# EAGLE design 24_cup_wash_sucction (EAGLE 8.5.1)

## Sheet 1 of 3
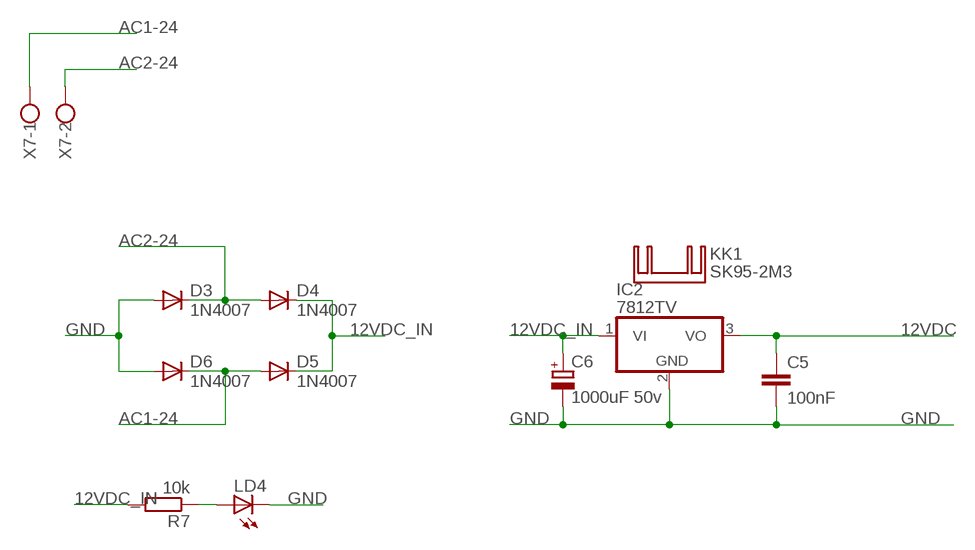
[diagram p0: schematic, sheet 1]

### Parts
C5  100nF  C-EU050-025X075  [C050-025X075]
C6  1000uF 50v  CPOL-EUE5-13  [E5-13]
D3  1N4007  1N4004  [DO41-10]
D4  1N4007  1N4004  [DO41-10]
D5  1N4007  1N4004  [DO41-10]
D6  1N4007  1N4004  [DO41-10]
IC2  7812TV  [TO220V]
KK1  SK95-2M3  [SK95-2M3]
LD4  LED5MM  [LED5MM]
R7  10k  R-EU_0207/10  [0207/10]
X7  W237-102  [W237-102]

### Nets
12VDC: C5.1 IC2.3(VO) ; also sheet 2
12VDC_IN: C6.+ D4.C D5.C IC2.1(VI) R7.2 ; also sheet 2,3
AC1-24: D5.A D6.C X7.1 ; also sheet 2,3
AC2-24: D3.C D4.A X7.2 ; also sheet 2,3
GND: C5.2 C6.- D3.A D6.A IC2.2(GND) LD4.K(C) ; also sheet 2,3
N$8: LD4.A R7.1

## Sheet 2 of 3
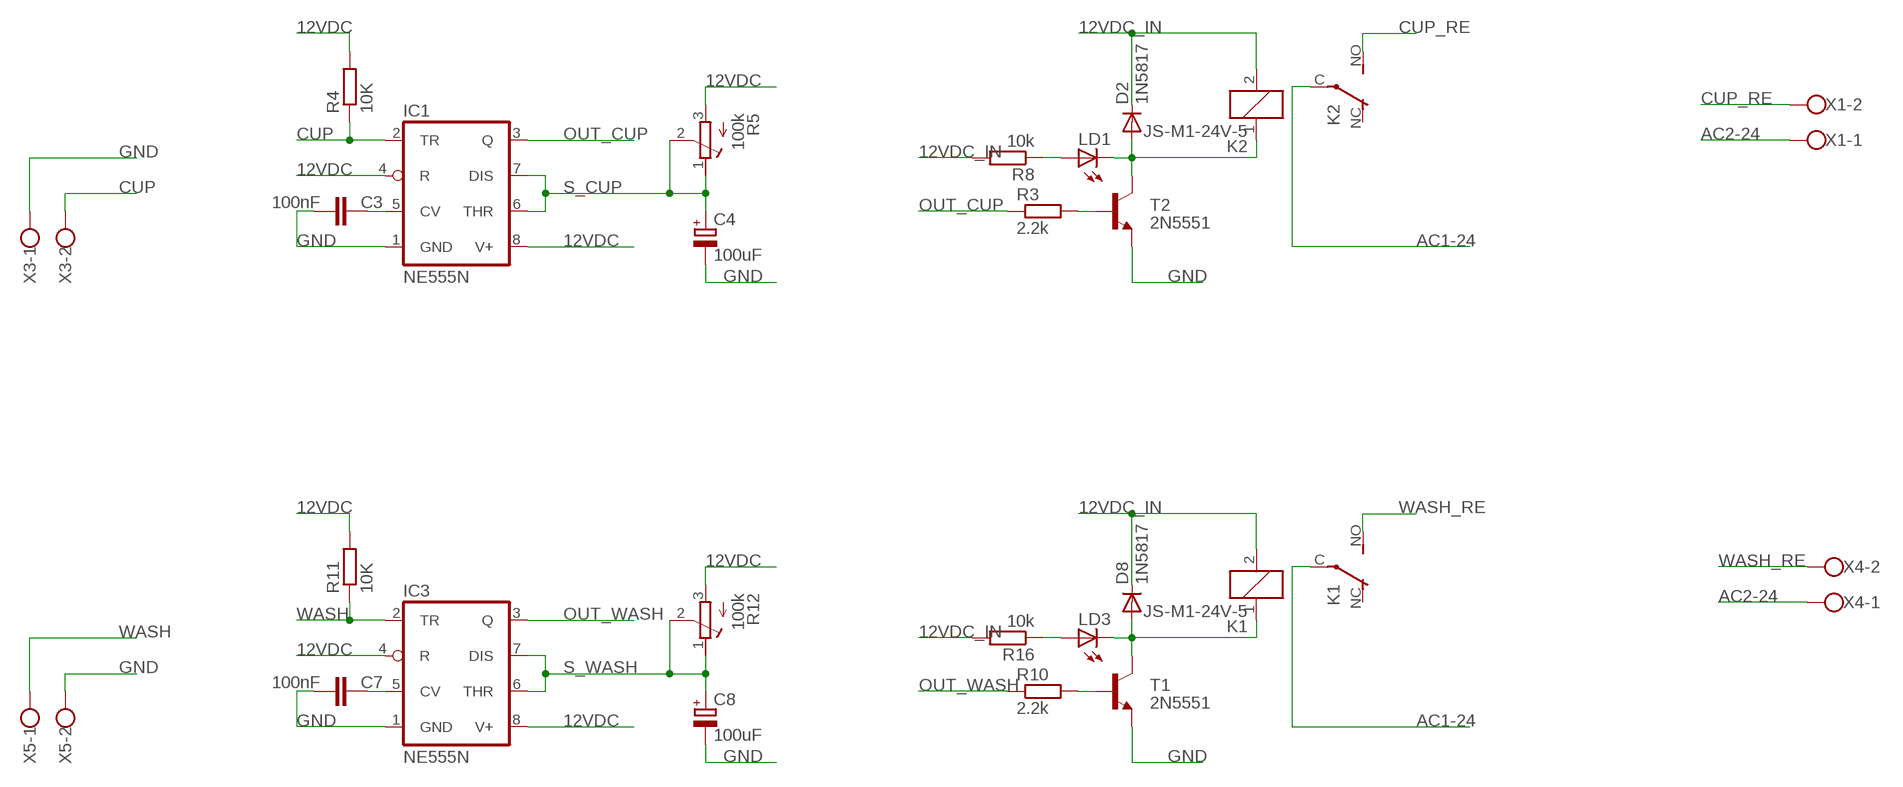
[diagram p1: schematic, sheet 2]

### Parts
C3  100nF  C-EU050-025X075  [C050-025X075]
C4  100uF  CPOL-EUE3.5-8  [E3,5-8]
C7  100nF  C-EU050-025X075  [C050-025X075]
C8  100uF  CPOL-EUE3.5-8  [E3,5-8]
D2  1N5817  1N4004  [DO41-10]
D8  1N5817  1N4004  [DO41-10]
IC1  NE555N  [DIL08-ROUND]
IC3  NE555N  [DIL08-ROUND]
K1  JS-M1-24V-5  JS-M1-12V-5  [JS-M]
K2  JS-M1-24V-5  JS-M1-12V-5  [JS-M]
LD1  LED5MM  [LED5MM]
LD3  LED5MM  [LED5MM]
R3  2.2k  R-EU_0207/10  [0207/10]
R4  10K  R-EU_0207/10  [0207/10]
R5  100k  R-TRIMMT93XA  [RTRIMT93XA]
R8  10k  R-EU_0207/10  [0207/10]
R10  2.2k  R-EU_0207/10  [0207/10]
R11  10K  R-EU_0207/10  [0207/10]
R12  100k  R-TRIMMT93XA  [RTRIMT93XA]
R16  10k  R-EU_0207/10  [0207/10]
T1  2N5551  2N2222  [TO92-EBC-OVAL]
T2  2N5551  2N2222  [TO92-EBC-OVAL]
X1  W237-102  [W237-102]
X3  W237-102  [W237-102]
X4  W237-102  [W237-102]
X5  W237-102  [W237-102]

### Nets
12VDC: IC1.4(R) IC1.8(V+) IC3.4(R) IC3.8(V+) R4.2 R5.3(A) R11.2 R12.3(A) ; also sheet 1
12VDC_IN: D2.C D8.C K1.2 K2.2 R8.2 R16.2 ; also sheet 1,3
AC1-24: K1.C(2:P) K2.C(2:P) ; also sheet 1,3
AC2-24: X1.1 X4.1 ; also sheet 1,3
CUP: IC1.2(TR) R4.1 X3.2
CUP_RE: K2.NO(2:S) X1.2
GND: C3.2 C4.- C7.2 C8.- IC1.1(GND) IC3.1(GND) T1.E T2.E X3.1 X5.2 ; also sheet 1,3
N$1: R3.2 T2.B
N$2: C3.1 IC1.5(CV)
N$3: D2.A K2.1 LD1.K(C) T2.C
N$5: C7.1 IC3.5(CV)
N$6: LD1.A R8.1
N$11: D8.A K1.1 LD3.K(C) T1.C
N$12: R10.2 T1.B
N$14: LD3.A R16.1
OUT_CUP: IC1.3(Q) R3.1
OUT_WASH: IC3.3(Q) R10.1
S_CUP: C4.+ IC1.6(THR) IC1.7(DIS) R5.1(E) R5.2(S)
S_WASH: C8.+ IC3.6(THR) IC3.7(DIS) R12.1(E) R12.2(S)
WASH: IC3.2(TR) R11.1 X5.1
WASH_RE: K1.NO(2:S) X4.2
Unconnected: K1.NC(2:O) K2.NC(2:O)

## Sheet 3 of 3
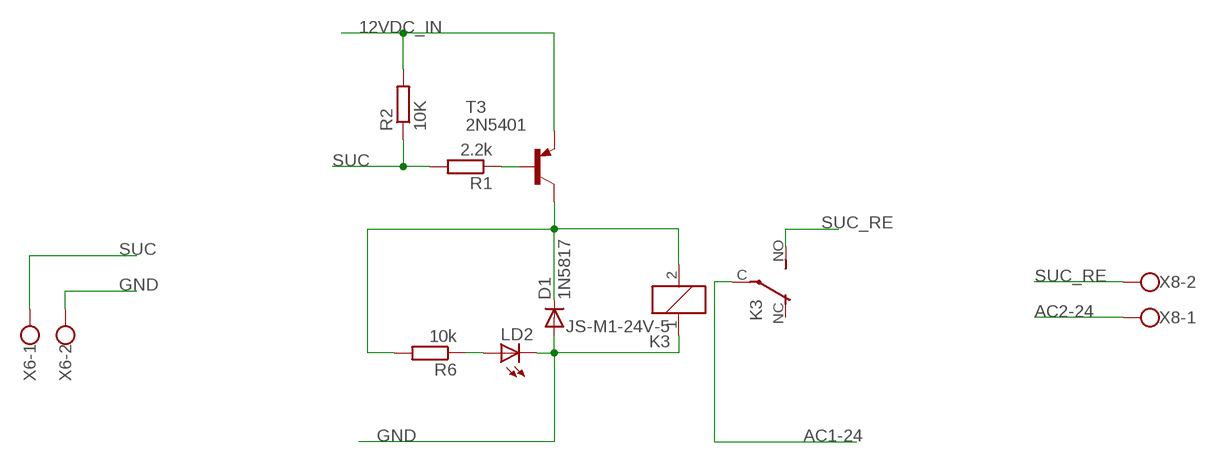
[diagram p2: schematic, sheet 3]

### Parts
D1  1N5817  1N4004  [DO41-10]
K3  JS-M1-24V-5  JS-M1-12V-5  [JS-M]
LD2  LED5MM  [LED5MM]
R1  2.2k  R-EU_0207/10  [0207/10]
R2  10K  R-EU_0207/10  [0207/10]
R6  10k  R-EU_0207/10  [0207/10]
T3  2N5401  2N5401-PNP-TO92-EBC  [TO92-EBC]
X6  W237-102  [W237-102]
X8  W237-102  [W237-102]

### Nets
12VDC_IN: R2.2 T3.E ; also sheet 1,2
AC1-24: K3.C(2:P) ; also sheet 1,2
AC2-24: X8.1 ; also sheet 1,2
GND: D1.A K3.1 LD2.K(C) X6.2 ; also sheet 1,2
N$7: R1.1 T3.B
N$9: LD2.A R6.1
NS1: D1.C K3.2 R6.2 T3.C
SUC: R1.2 R2.1 X6.1
SUC_RE: K3.NO(2:S) X8.2
Unconnected: K3.NC(2:O)

## Library data of the parts
C3 C5 C7 = rcl:C-EU: CAPACITOR, European symbol; SPICEPREFIX: C
C4 C6 C8 = rcl:CPOL-EU: POLARIZED CAPACITOR, European symbol; SPICEPREFIX: C
D1-D6 D8 = adafruit:1N4004: DIODE General purpose 1N400x type rectifier (With bigger pads) http://www.ladyada.net/library/pcb/eaglelibrary.html
IC1 IC3 = adafruit:*555: TIMER Changed DIP package to have round (not oval) pin pads http://www.ladyada.net/library/pcb/eaglelibrary.html
IC2 = linear:78*: Positive VOLTAGE REGULATOR Source: http://cache.national.com/ds/LM/LM78L05.pdf http://www.fairchildsemi.com/ds/LM/LM7805.pdf
K1-K3 = relay:JS-M1*: Automotive Ultra-Miniature Power Relay NAiS Source: http://www.mew-europe.com/.. en_ds_61211_0000.pdf; MF: FARNELL; MPN: JSM1-12V-5; OC_FARNELL: 910351; OC_NEWARK: 14J1764
KK1 = heatsink:SK95-2M3: HEATSINK manufacturer Fischer/distributor Buerklin
LD1-LD4 = led:LED: LED OSRAM: - CHIPLED LG R971, LG N971, LY N971, LG Q971, LY Q971, LO R971, LY R971 LH N974, LH R974 LS Q976, LO Q976, LY Q976 LO Q996 - Hyper CHIPLED LW Q18S LB Q993, LB Q99A, LB R99A - SideLED LS A670, LO A670, LY A670, LG A670, LP A670 LB A673, LV A673, LT A673, LW A673 LH A674 LY A675 LS A676, LA A676, LO A676, LY A676, LW A676 LS A679, LY A679, LG A679 - Hyper Micro SIDELED® LS Y876, LA Y876, LO Y876, LY Y876 LT Y87S - SmartLED LW L88C, LW L88S LB L89C, LB L89S, LG L890 LS L89K, LO L89K, LY L89K LS L896, LA L896, LO L896, LY L896 - TOPLED LS T670, LO T670, LY T670, LG T670, LP T670 LSG T670, LSP T670, LSY T670, LOP T670, LYG T670 LG T671, LOG T671, LSG T671 LB T673, LV T673, LT T673, LW T673 LH T674 LS T676, LA T676, LO T676, LY T676, LB T676, LH T676, LSB T676, LW T676 LB T67C, LV T67C, LT T67C, LS T67K, LO T67K, LY T67K, LW E67C LS E67B, LA E67B, LO E67B, LY E67B, LB E67C, LV E67C, LT E67C LW T67C LS T679, LY T679, LG T679 LS T770, LO T770, LY T770, LG T770, LP T770 LB T773, LV T773, LT T773, LW T773 LH T774 LS E675, LA E675, LY E675, LS T675 LS T776, LA T776, LO T776, LY T776, LB T776 LHGB T686 LT T68C, LB T68C - Hyper Mini TOPLED® LB M676 - Mini TOPLED Santana® LG M470 LS M47K, LO M47K, LY M47K Source: http://www.osram.convergy.de/
R1-R4 R6-R8 R10 R11 R16 = rcl-2:R-EU_: RESISTOR, European symbol
R5 R12 = rcl:R-TRIMM: Trimm resistor; SPICEMODEL: X; SPICEPREFIXL: POT
T1 T2 = adafruit:2N2222: NPN TRANSISTOR Big oval pads
T3 = transistor-neu-to92:*-PNP-: PNP Transistror
X1 X3-X8 = con-wago-500:W237-102: WAGO SCREW CLAMP

## Board
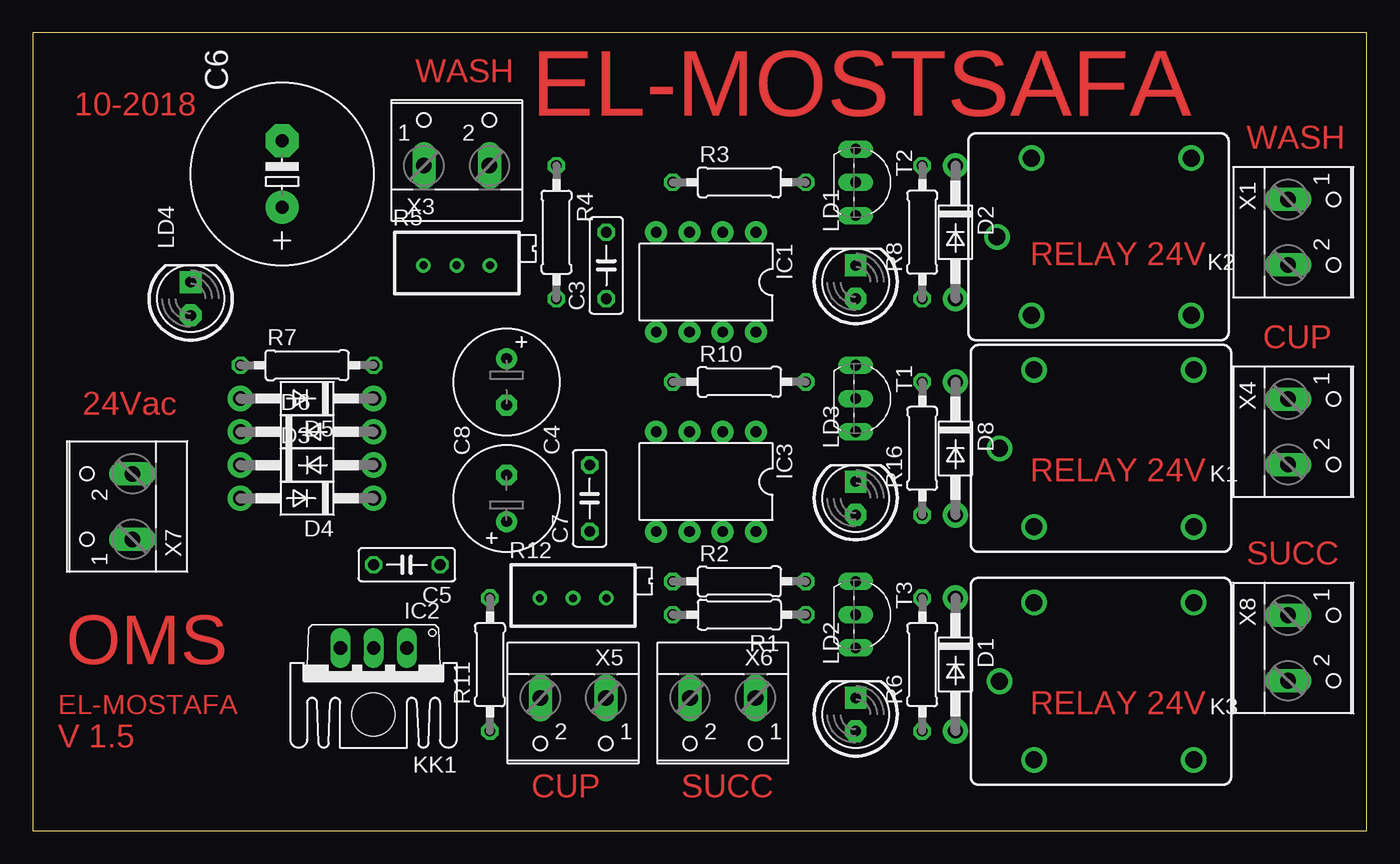
[diagram p3: board, top side]
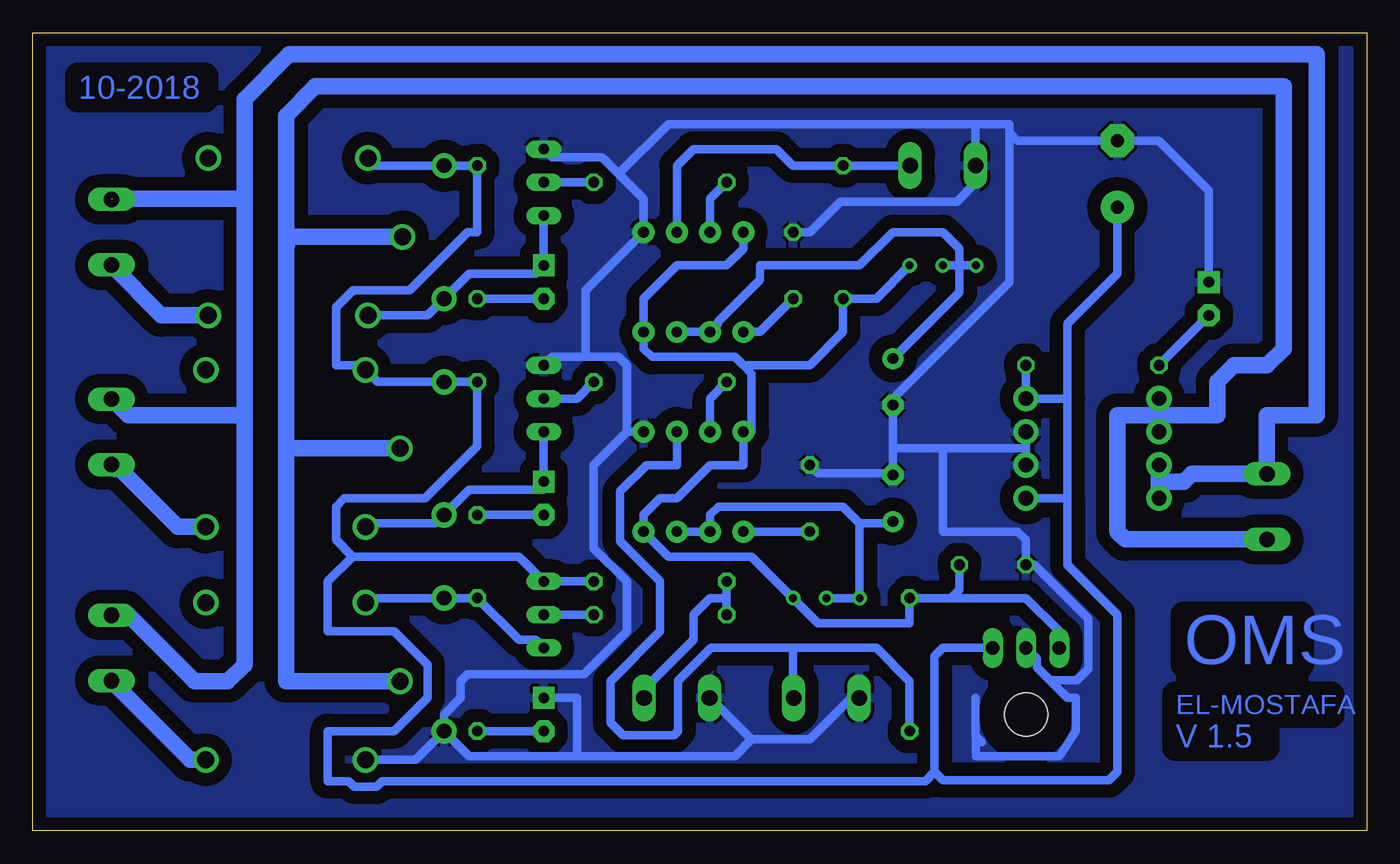
[diagram p4: board, bottom side, seen from below]

Size 101.91 x 60.95 mm. Coordinates in mm from the lower left corner, seen from the top.
Outline: 0,0 101.91,0 101.91,60.95 0,60.95 0,0
Copper layers (1*16): Top 0.035mm / dielectric 1.5mm / Bottom 0.035mm
Design rules "default *": minimum track width 25mil, minimum drill 0.35mm, track to track 40mil, track to pad 40mil, pad to pad 6mil, via to via 6mil, smd to smd 6mil, copper to edge 40mil, drill to drill 6mil, minimum pad ring 10mil, minimum via ring 8mil, stop-mask expansion 4mil, vias tented up to drill 0mil, thermal gap 10mil

### Footprints (pad centres in the part's own frame; a part is rotated, then mirrored left to right if it is on the bottom)
C050-025X075 = drill 0.813 octagon: 1 -2.54,0; 2 2.54,0
E3,5-8 = drill 0.813 pad 1.6: + -1.778,0 | drill 0.813 pad 1.6 octagon: - 1.778,0
E5-13 = drill 1.016 pad 2.54: + -2.54,0 | drill 1.016 pad 2.54 octagon: - 2.54,0
DO41-10 = drill 1.118 pad 1.93: A 5.08,0; C -5.08,0
DIL08-ROUND = drill 0.813 pad 1.676: 1 -3.81,-3.81; 2 -1.27,-3.81; 3 1.27,-3.81; 4 3.81,-3.81; 5 3.81,3.81; 6 1.27,3.81; 7 -1.27,3.81; 8 -3.81,3.81
TO220V = drill 1.016 long: 1 -2.54,-2.54; 2 0,-2.54; 3 2.54,-2.54
JS-M = drill 1.3: 1 6.7,6; 2 6.7,-6; C 9.335,0; NC -5.5,-6; NO -5.5,6
SK95-2M3 = hole 3.302: 0,2.54
LED5MM = drill 0.813 pad 1.676 octagon: A -1.27,0 | drill 0.813 pad 1.676 square: K 1.27,0
0207/10 = drill 0.813 octagon: 1 -5.08,0; 2 5.08,0
RTRIMT93XA = drill 0.61: 1 0,-2.54; 2 0,0; 3 0,2.54
TO92-EBC-OVAL = drill 0.813 long: B 0,-1.27; C 2.54,-1.27; E -2.54,-1.27
TO92-EBC = drill 0.813 long: B 0,-1.27; C 2.54,-1.27; E -2.54,-1.27
W237-102 = drill 1.194 long: 1 -2.5,-1.27; 2 2.5,-1.27

### Placement (x,y rotation side)
C3  43.81,43.18 90 top
C4  36.2,34.29 270 top
C5  28.57,20.32 180 top
C6  19.05,50.16 90 top
C7  42.55,25.4 90 top
C8  36.2,25.4 90 top
D1  70.48,12.7 270 top
D2  70.48,45.72 270 top
D3  20.95,27.94 0 top
D4  20.95,25.4 180 top
D5  20.95,33.02 180 top
D6  20.95,30.48 0 top
D8  70.48,29.21 270 top
IC1  51.44,41.91 180 top
IC2  26.04,11.43 180 top
IC3  51.44,26.67 180 top
K1  83.19,29.21 180 top
K2  83,45.37 180 top
K3  83.19,11.43 180 top
KK1  26.04,11.43 180 top
LD1  62.87,41.91 90 top
LD2  62.87,8.89 90 top
LD3  62.87,25.4 90 top
LD4  12.06,40.64 90 top
R1  53.98,16.51 180 top
R2  53.98,19.05 0 top
R3  53.98,49.53 0 top
R4  40.01,45.72 270 top
R5  32.38,43.18 270 top
R6  67.94,12.7 90 top
R7  20.95,35.56 0 top
R8  67.94,45.72 90 top
R10  53.98,34.29 0 top
R11  34.92,12.7 90 top
R12  41.27,17.78 270 top
R16  67.94,29.21 90 top
T1  64.14,33.02 270 top
T2  64.14,49.53 270 top
T3  64.14,16.51 270 top
X1  97.16,45.72 270 top
X3  32.38,52.07 0 top
X4  97.16,30.48 270 top
X5  41.27,8.89 180 top
X6  52.7,8.89 180 top
X7  6.35,24.77 90 top
X8  97.16,13.97 270 top

### Tracks (layer width: path | path; a pad name or v marks a point on that pad's centre or on a via)
12VDC
  Bottom 0.635: 47.62,35.56 46.99,34.92 46.99,30.48 IC3.4 47.62,27.94 50.16,27.94 52.7,25.4 53.98,25.4 55.24,24.13 IC3.8 53.34,20.95 46.99,20.95 R12.3 41.91,15.88 34.92,15.88 R11.2 31.75,17.78 | 47.62,35.56 48.26,36.2 54.61,36.2 55.24,36.83 IC1.8 55.24,40.64 52.7,43.18 48.9,43.18 47.62,44.45 IC1.4 | IC2.3 23.5,15.24 26.04,17.78 31.75,17.78 | R5.3 37.47,40.64 R4.2 40.01,38.1 42.55,35.56 47.62,35.56 | C5.1 31.11,18.41 31.75,17.78
12VDC_IN
  Bottom 0.635: K2.2 76.2,50.8 D2.C R8.2 67.94,45.72 68.71,45.72 73.13,41.3 77.45,41.3 78.74,40.01 78.74,35.56 76.83,35.56 K1.2 75.56,34.29 D8.C R16.2 67.94,29.38 71.93,25.4 78.11,25.4 78.74,24.77 78.74,22.23 77.47,20.95 | R2.2 T3.E 64.77,20.95 77.47,20.95 | 33.02,4.51 33.02,13.34 32.38,13.97 IC2.1 | 33.02,4.51 32.38,3.87 19.68,3.87 19.05,4.51 19.05,16.51 22.86,20.32 22.86,25.4 | 33.02,4.51 33.72,3.81 75.2,3.81 75.63,3.38 77.34,3.38 77.77,3.81 79.38,3.81 79.38,7.62 74.3,7.62 71.75,10.16 71.75,12.7 74.3,15.24 79.38,15.24 79.38,19.05 77.47,20.95 | 22.86,33.02 D5.C R7.2 | 22.86,25.4 22.86,33.02 | D4.C 22.86,25.4 | 22.86,33.02 22.86,38.73 19.05,42.55 C6.+
AC1-24
  Bottom 0.635: D6.C 15.88,31.75 D5.A
  Bottom 1.27: 82.55,44.45 82.55,29.21 | 82.55,29.21 82.55,11.43 K3.C | K1.C 82.55,29.21 | 82.55,44.45 82.27,45.37 K2.C | 82.55,44.45 82.55,54.61 80.31,56.84 6.35,56.84 6.35,36.83 7.62,35.56 10.16,35.56 11.43,34.29 11.43,31.75 15.88,31.75 19.05,31.75 19.05,22.86 18.45,22.27 X7.1 | D6.C D5.A
AC2-24  (1 unrouted)
  Bottom 0.635: 95.89,16.51 X8.1 | 95.89,32.38 X4.1 | 95.89,47.62 X1.1 | D3.C 15.88,27.86 15.88,26.67 D4.A
  Bottom 1.27: 85.72,48.26 85.72,31.75 | 85.72,31.75 85.72,12.7 87,11.43 89.53,11.43 94.61,16.51 95.89,16.51 | X4.1 95.89,33.02 94.61,31.75 85.72,31.75 | 85.72,48.26 95.89,48.26 | 85.72,48.26 85.72,55.88 82.31,59.3 3.81,59.3 3.81,31.75 7.62,31.75 X7.2 13.38,27.27 13.97,26.67 15.88,26.67 | D4.A 15.88,27.86
CUP
  Bottom 0.635: IC1.2 52.7,50.8 51.44,52.07 45.09,52.07 43.81,50.8 R4.1 X3.2
CUP_RE
  Bottom 0.635: 95.89,43.18 X1.2
  Bottom 1.27: K2.NO 92.08,39.37 95.89,43.18
GND
  Bottom 0.635: 46.99,6.99 42.55,6.99 39.37,10.16 X5.2 | 46.99,6.99 50.16,10.16 X6.2 | D1.A 68.58,5.71 60.33,5.71 | T2.E 62.23,51.44 58.42,51.44 57.15,50.16 | 57.15,50.16 55.24,48.26 IC1.1 59.69,41.27 59.69,36.2 | C7.2 41.91,27.3 36.2,27.3 | 36.2,27.3 36.2,29.21 | 36.2,29.21 C4.- 36.2,33.02 27.3,41.91 27.3,53.34 | 36.2,27.3 C8.- | 36.2,29.21 32.38,29.21 | 57.15,50.16 53.34,53.98 29.84,53.98 | 29.84,53.98 27.3,53.98 27.3,53.34 | 32.38,29.21 32.38,22.86 26.67,22.86 26.04,22.23 C5.2 25.4,20.32 21.27,16.19 21.27,12.38 22.16,11.49 24.2,11.49 | 24.2,11.49 25.21,12.5 25.21,13.14 IC2.2 | 29.84,53.98 29.89,53.94 X3.1 29.89,49.57 29.84,49.53 31.32,48.06 40.21,48.06 42.55,45.72 C3.2 | 56.52,30.48 59.05,27.94 59.05,21.59 56.52,19.05 56.52,15.24 59.8,11.95 68.69,11.95 69.22,11.43 69.22,10.16 70.48,8.89 D1.A | 56.52,30.48 IC3.1 | K3.1 72.67,5.43 D1.A | 46.99,6.99 48.26,5.71 60.33,5.71 | LD2.K 60.33,10.16 60.33,5.71 | 59.69,36.2 57.15,36.2 56.52,35.56 56.52,30.48 | 59.69,36.2 62.23,36.2 T1.E | 24.2,11.49 22.87,10.16 22.23,10.16 22.23,7.62 23.5,5.71 29.84,5.71 29.84,7.22 | 29.84,7.22 29.91,7.29 29.91,10.16 | 29.84,7.22 29.41,6.79 | LD4.K 12.06,48.9 15.88,52.7 C6.- 26.67,52.7 27.3,53.34 | D6.A 26.04,29.21 | 26.04,29.21 D3.A | 32.38,29.21 27.94,29.21 27.3,29.21 26.04,29.21
  pour Bottom: 0,60.96 101.6,60.96 101.6,0 0,0
N$1
  Bottom 0.635: R3.2 T2.B
N$2
  Bottom 0.635: C3.1 46.35,38.1 IC1.5
N$3
  Bottom 0.635: T2.C LD1.K 63.5,42.55 68.58,42.55 D2.A 71.75,39.37 K2.1
N$5
  Bottom 0.635: IC3.5 C7.1
N$6
  Bottom 0.635: LD1.A R8.1
N$7
  Bottom 0.635: T3.B R1.1
N$8
  Bottom 0.635: R7.1 LD4.A
N$9
  Bottom 0.635: LD2.A R6.1
N$11
  Bottom 0.635: T1.C LD3.K 62.87,26.04 68.58,26.04 D8.A 71.12,23.5 76.2,23.5 K1.1
N$12
  Bottom 0.635: R10.2 60.33,33.02 T1.B
N$14
  Bottom 0.635: LD3.A R16.1
NS1
  Bottom 0.635: T3.C 63.5,14.61 64.77,14.61 R6.2 D1.C 75.56,17.78 K3.2
OUT_CUP
  Bottom 0.635: R3.1 50.16,48.26 IC1.3
OUT_WASH
  Bottom 0.635: IC3.3 50.16,33.02 R10.1
S_CUP
  Bottom 0.635: IC1.7 IC1.6 49.54,38.72 49.54,38.89 46.35,42.08 46.35,43.18 38.73,43.18 36.2,45.72 32.38,45.72 31.11,44.45 31.11,43.18 | 31.11,43.18 R5.2 | R5.1 31.11,43.18 | 31.11,43.18 31.11,41.15 C4.+
S_WASH
  Bottom 0.635: IC3.7 IC3.6 50.16,24.13 49.53,24.77 40.01,24.77 38.73,23.5 | R12.2 R12.1 38.73,23.5 | 38.73,23.5 36.2,23.5 C8.+
SUC
  Bottom 0.635: R2.1 48.9,17.78 | 48.9,17.78 R1.2 | 48.9,17.78 50.16,17.78 51.44,16.51 51.44,14.59 55.24,10.78 55.24,10.16 X6.1
SUC_RE
  Bottom 0.635: 95.89,11.43 X8.2
  Bottom 1.27: K3.NO 89.89,5.43 95.89,11.43
WASH
  Bottom 0.635: R11.1 34.92,11.43 37.47,13.97 43.81,13.97 | 43.77,11.47 X5.1 43.81,10.2 43.81,13.97 | IC3.2 52.7,27.94 55.02,27.94 57.04,25.92 57.04,22.12 56.52,21.6 56.52,21.59 53.98,19.05 53.98,15.24 57.78,11.43 57.78,8.26 56.82,7.29 52.93,7.29 52.6,7.62 52.6,11.46 50.08,13.97 43.81,13.97
WASH_RE
  Bottom 0.635: 95.89,27.94 X4.2
  Bottom 1.27: 95.89,27.94 95.57,27.62 95.23,27.62 90.81,23.21 K1.NO

### Text on the board
Top: WASH | 10-2018 | EL-MOSTSAFA | WASH | RELAY 24V | CUP | 24Vac | RELAY 24V | SUCC | OMS | EL-MOSTAFA | RELAY 24V | V 1.5 | CUP | SUCC
Bottom: 10-2018 | OMS | EL-MOSTAFA | V 1.5